# EAGLE design ESP8266_uS_board (EAGLE 9.3.2)
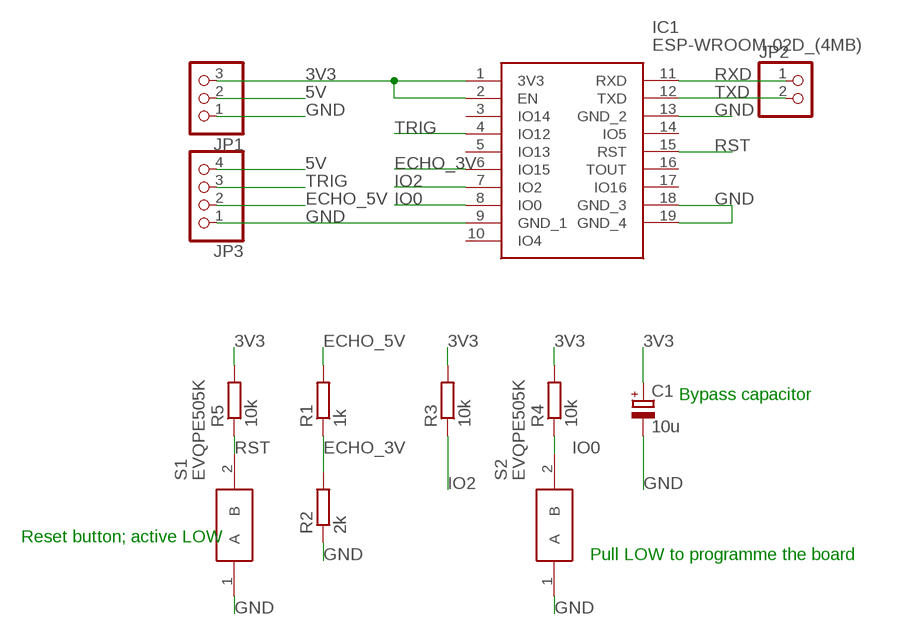
[diagram p0: schematic, sheet 1]

## Parts
C1  10u  CPOL-EUD/7343-31R  [D/7343-31R]
IC1  ESP-WROOM-02D_(4MB)  [ESPWROOM02D]
JP1  PINHD-1X3  [1X03]
JP2  PINHD-1X2  [1X02]
JP3  PINHD-1X4  [1X04]
R1  1k  R-EU_R0805  [R0805]
R2  2k  R-EU_R0805  [R0805]
R3  10k  R-EU_R0805  [R0805]
R4  10k  R-EU_R0805  [R0805]
R5  10k  R-EU_R0805  [R0805]
S1  EVQPE505K  [EVQPE505K]
S2  EVQPE505K  [EVQPE505K]

## Nets
3V3: C1.+ IC1.1(3V3) IC1.2(EN) JP1.3 R3.2 R4.2 R5.2
5V: JP1.2 JP3.4
ECHO_3V: IC1.6(IO15) R1.1 R2.2
ECHO_5V: JP3.2 R1.2
GND: C1.- IC1.9(GND_1) IC1.13(GND_2) IC1.18(GND_3) IC1.19(GND_4) JP1.1 JP3.1 R2.1 S1.1(A) S2.1(A)
IO0: IC1.8(IO0) R4.1 S2.2(B)
IO2: IC1.7(IO2) R3.1
RST: IC1.15(RST) R5.1 S1.2(B)
RXD: IC1.11(RXD) JP2.1
TRIG: IC1.4(IO12) JP3.3
TXD: IC1.12(TXD) JP2.2
Unconnected: IC1.3(IO14) IC1.5(IO13) IC1.10(IO4) IC1.14(IO5) IC1.16(TOUT) IC1.17(IO16)

## Notes on the sheet
- Bypass capacitor
- Reset button; active LOW
- Pull LOW to programme the board

## Library data of the parts
C1 = rcl:CPOL-EU: POLARIZED CAPACITOR, European symbol; SPICEPREFIX: C
IC1 = SamacSys_Parts:ESP-WROOM-02D_(4MB): WiFi Modules (802.11) SMD Module, ESP8266EX, 32Mbits SPI flash, UART Mode, PCB antenna Source: Datasheet <https://www.mouser.in/datasheet/2/891/esp-wroom-02d_esp-wroom-02u_datasheet_en-1365835.pdf>; DESCRIPTION: WiFi Modules (802.11) SMD Module, ESP8266EX, 32Mbits SPI flash, UART Mode, PCB antenna; HEIGHT: 3.2mm; MANUFACTURER_NAME: Espressif; MANUFACTURER_PART_NUMBER: ESP-WROOM-02D (4MB); MOUSER_PART_NUMBER: 356-ESPWROOM02D(4MB)
JP1 = pinhead:PINHD-1X3: PIN HEADER
JP2 = pinhead:PINHD-1X2: PIN HEADER
JP3 = pinhead:PINHD-1X4: PIN HEADER
R1-R5 = rcl:R-EU_: RESISTOR, European symbol; SPICEPREFIX: R
S1 S2 = SamacSys_Parts:EVQPE505K: Tact switch,THT,SPST,black,1.6N op force Black Push Plate Tactile Switch, SPST-NO 50 mA 5mm Source: Datasheet <https://industrial.panasonic.com/cdbs/www-data/pdf/ATK0000/ATK0000C408.pdf>; ALLIED_NUMBER: 70270546; ALLIED_PRICE-STOCK: https://www.alliedelec.com/panasonic-evq-pe505k/70270546/; DESCRIPTION: Tact switch,THT,SPST,black,1.6N op force Black Push Plate Tactile Switch, SPST-NO 50 mA 5mm; HEIGHT: 5mm; MANUFACTURER_NAME: Panasonic; MANUFACTURER_PART_NUMBER: EVQPE505K; RS_PART_NUMBER: 7561565P; RS_PRICE-STOCK: http://uk.rs-online.com/web/p/products/7561565P

## Board
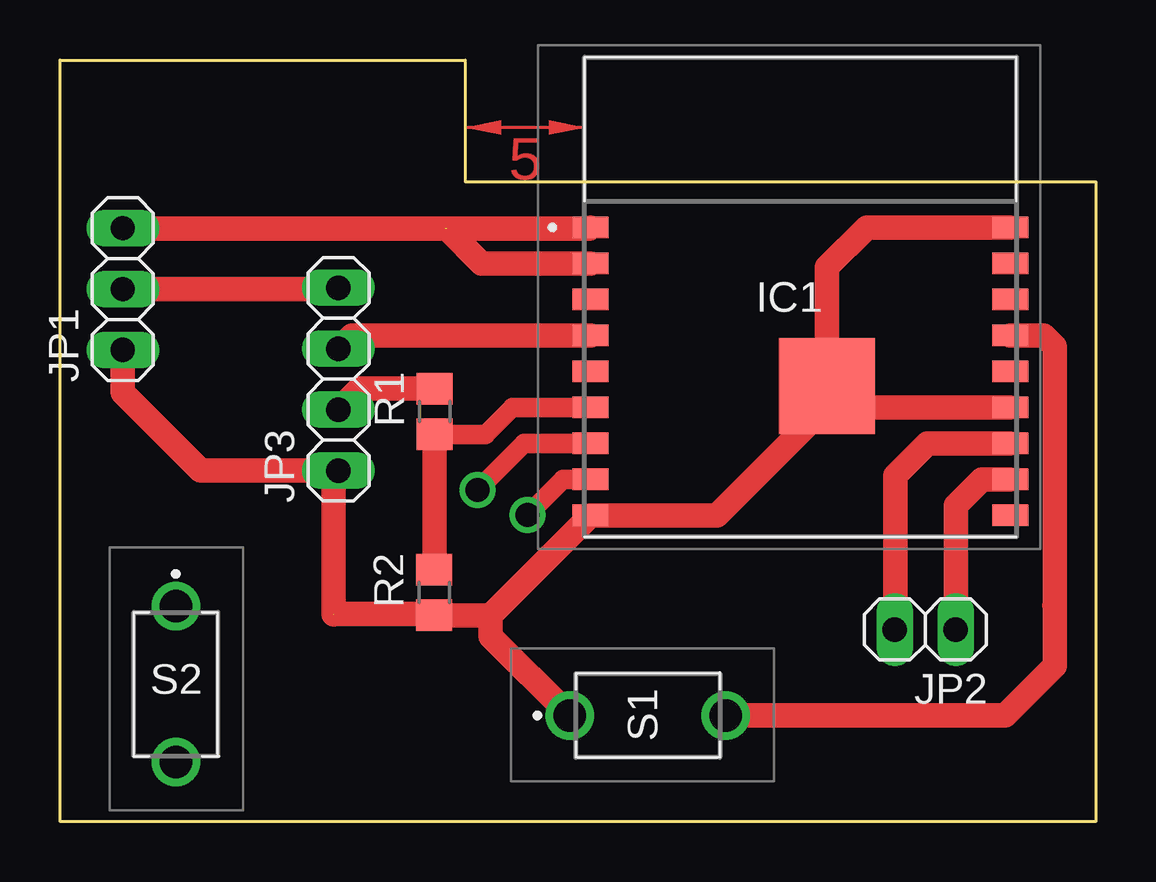
[diagram p1: board, top side]
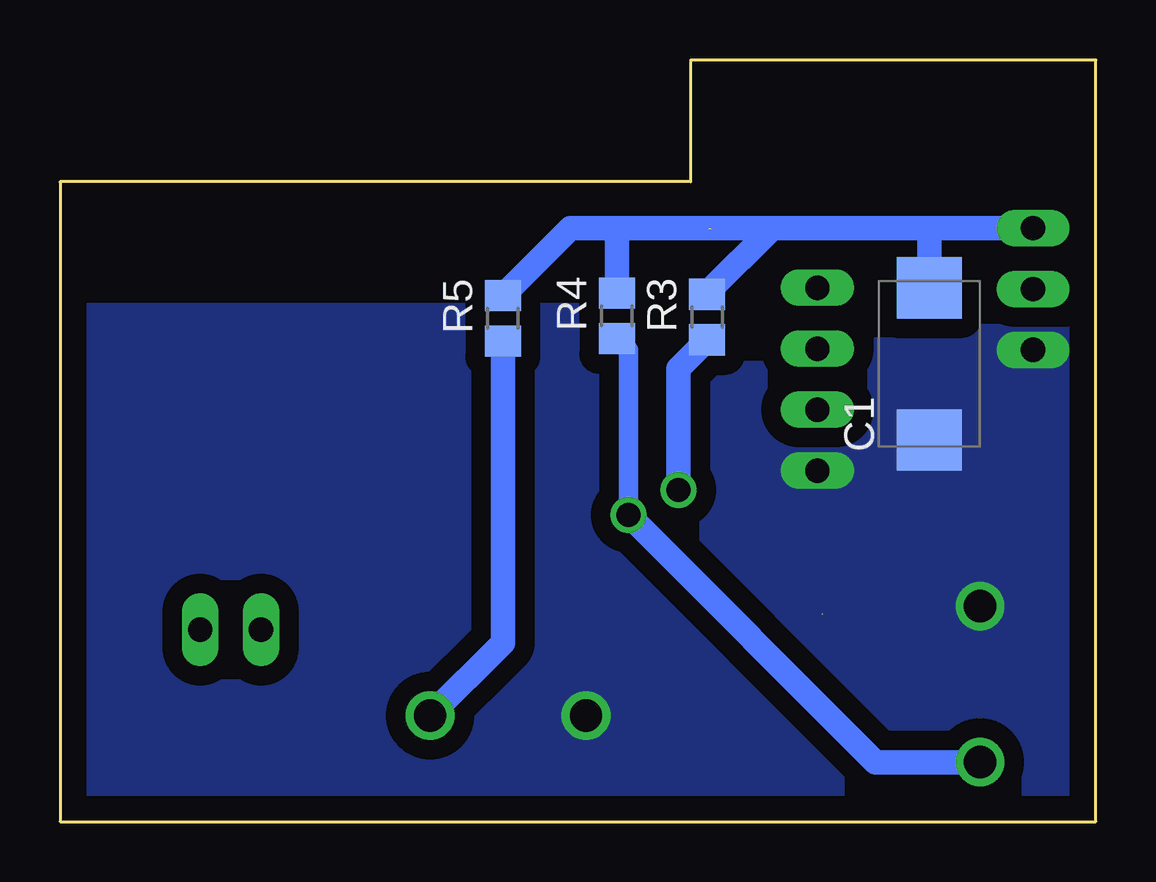
[diagram p2: board, bottom side, seen from below]

Size 43.18 x 31.75 mm. Coordinates in mm from the lower left corner, seen from the top.
Outline: 0,0 0,31.75 16.89,31.75 16.89,26.67 43.18,26.67 43.18,0 0,0
Copper layers (1*16): Top 0.035mm / dielectric 1.5mm / Bottom 0.035mm
Design rules "default *": minimum track width 9mil, minimum drill 0.35mm, track to track 9mil, track to pad 9mil, pad to pad 9mil, via to via 9mil, smd to smd 9mil, copper to edge 40mil, drill to drill 9mil, minimum pad ring 10mil, minimum via ring 8mil, stop-mask expansion 4mil, vias tented up to drill 0mil, thermal gap 10mil

### Footprints (pad centres in the part's own frame; a part is rotated, then mirrored left to right if it is on the bottom)
D/7343-31R = smd 2.55 x 2.7: + 3.175,0; - -3.175,0
ESPWROOM02D = smd 1.5 x 0.9: 1 -8.025,2.9; 2 -8.025,1.4; 3 -8.025,-0.1; 4 -8.025,-1.6; 5 -8.025,-3.1; 6 -8.025,-4.6; 7 -8.025,-6.1; 8 -8.025,-7.6; 9 -8.025,-9.1; 10 9.475,-9.1; 11 9.475,-7.6; 12 9.475,-6.1; 13 9.475,-4.6; 14 9.475,-3.1; 15 9.475,-1.6; 16 9.475,-0.1; 17 9.475,1.4; 18 9.475,2.9 | smd 4 x 4: 19 1.825,-3.71
1X03 = drill 1.016 long: 1 -2.54,0; 2 0,0; 3 2.54,0
1X02 = drill 1.016 long: 1 -1.27,0; 2 1.27,0
1X04 = drill 1.016 long: 1 -3.81,0; 2 -1.27,0; 3 1.27,0; 4 3.81,0
R0805 = smd 1.3 x 1.5: 1 -0.95,0; 2 0.95,0
EVQPE505K = drill 1.35 pad 2.025: 1 -0.025,3.031; 2 -0.025,-3.469

### Placement (x,y rotation side)
C1  6.93,19.08 90 bottom
IC1  30.15,21.87 0 top
JP1  2.62,22.2 90 top
JP2  36.07,8 180 top
JP3  11.61,18.44 90 top
R1  15.62,17.09 90 top
R2  15.6,9.55 90 top
R3  16.21,21.03 90 bottom
R4  19.96,21.08 90 bottom
R5  24.71,20.98 90 bottom
S1  24.28,4.45 90 top
S2  4.85,5.94 0 top

### Tracks (layer width: path | path; a pad name or v marks a point on that pad's centre or on a via)
3V3  (1 unrouted)
  Top 1.016: IC1.1 22.07,24.72 16.05,24.72 | JP1.3 2.64,24.72 16.13,24.72 17.58,23.27 IC1.2
  Bottom 1.016: R3.2 16.2,22.02 13.49,24.74 | 13.49,24.74 6.99,24.74 | 6.99,24.74 JP1.3 | C1.+ 6.93,24.69 6.99,24.74 | R5.2 21.91,24.74 19.96,24.74 | 19.96,24.74 13.49,24.74 | R4.2 19.96,24.74
5V
  Top 1.016: JP3.4 11.56,22.2 JP1.2
ECHO_3V
  Top 0.813: IC1.6 18.87,17.27 17.74,16.14 R1.1
  Top 1.016: R1.1 15.62,10.53 R2.2
ECHO_5V
  Top 1.016: JP3.2 12.5,18.06 15.61,18.06 R1.2
GND  (1 unrouted)
  Top 1.016: JP1.1 2.62,17.88 5.87,14.63 JP3.1 11.41,14.44 11.41,8.63 | 11.4,8.66 15.54,8.66 R2.1 17.96,8.6 | 17.96,8.6 IC1.9 27.39,12.77 31.98,17.35 | IC1.18 33.63,24.77 31.98,23.11 IC1.19 31.98,17.35 | IC1.13 32.31,17.27 32.18,17.14 31.98,17.35 | S1.1 17.96,7.72 17.96,8.6
  pour Bottom (isolate 0.813, no thermals): 0,21.11 43.03,21.11 42.8,20.88 42.8,0.18 0.23,0.18 0.23,20.93 0.1,21.06
IO0  (via drill 1 pad 0.8)
  Top 0.813: IC1.8 20.98,14.27 v19.48,12.78
  Bottom 0.813: v19.48,12.78 19.48,19.65 R4.1
  Bottom 1.016: v19.48,12.78 9.18,2.48 S2.2
IO2  (via drill 1)
  Top 0.813: IC1.7 19.35,15.77 v17.4,13.82
  Bottom 1.016: v17.4,13.82 17.4,18.89 R3.1
RST
  Top 1.016: IC1.15 41.02,20.27 41.48,19.81 41.48,9.04 | 41.48,9.04 41.45,9.02 | 41.48,9.04 41.48,6.49 39.41,4.42 S1.2
  Bottom 1.016: S1.2 24.71,7.46 R5.1
RXD
  Top 1.016: JP2.1 37.34,13.18 38.42,14.27 IC1.11
TRIG
  Top 1.016: IC1.4 12.17,20.27 JP3.3
TXD
  Top 1.016: JP2.2 34.82,8.03 34.82,14.43 36.17,15.77 IC1.12
(copper drawn outside any net)
  shapes: Top area x1